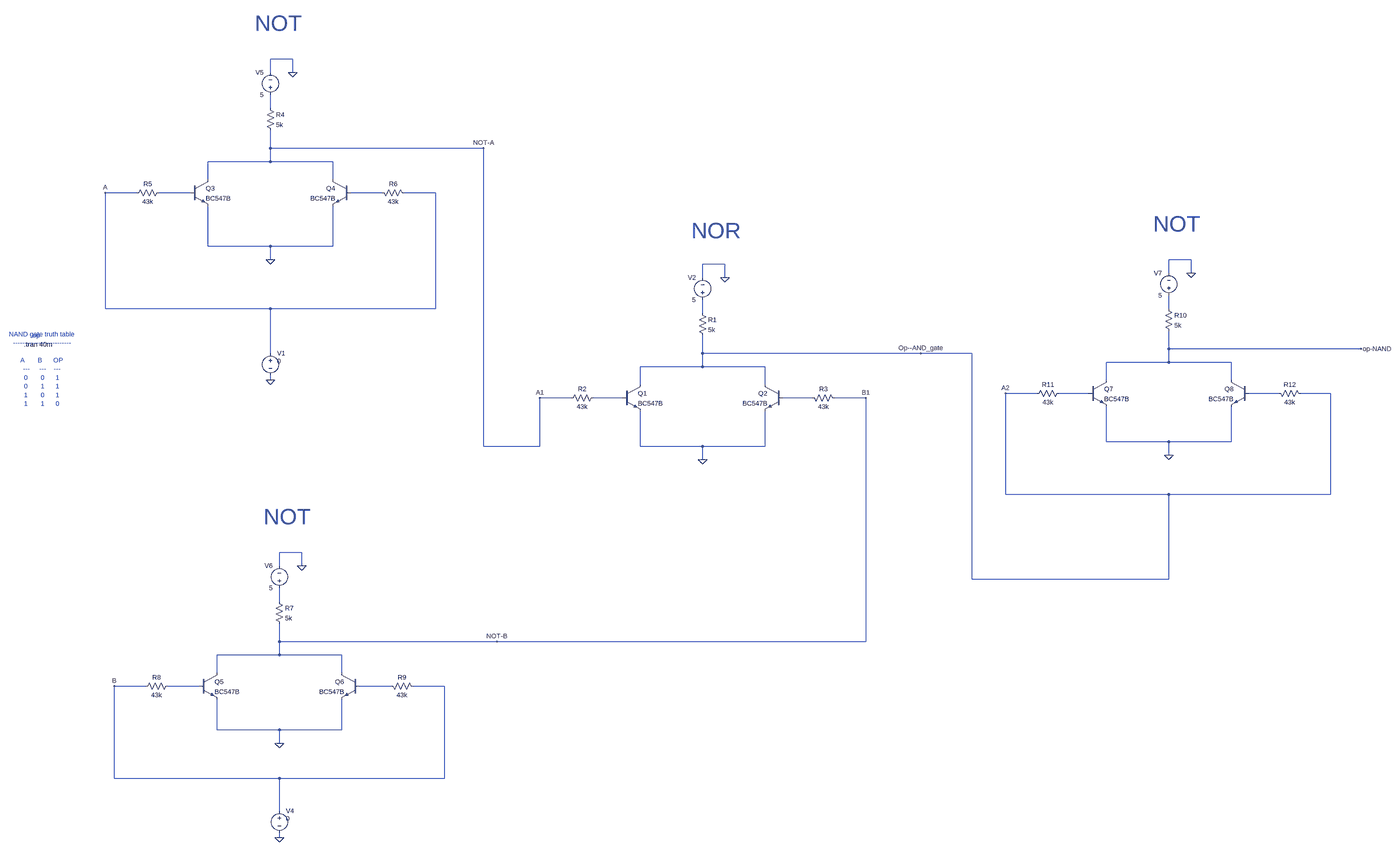
[diagram p0: schematic NAND_using_NOR_gate.asc, whole sheet]
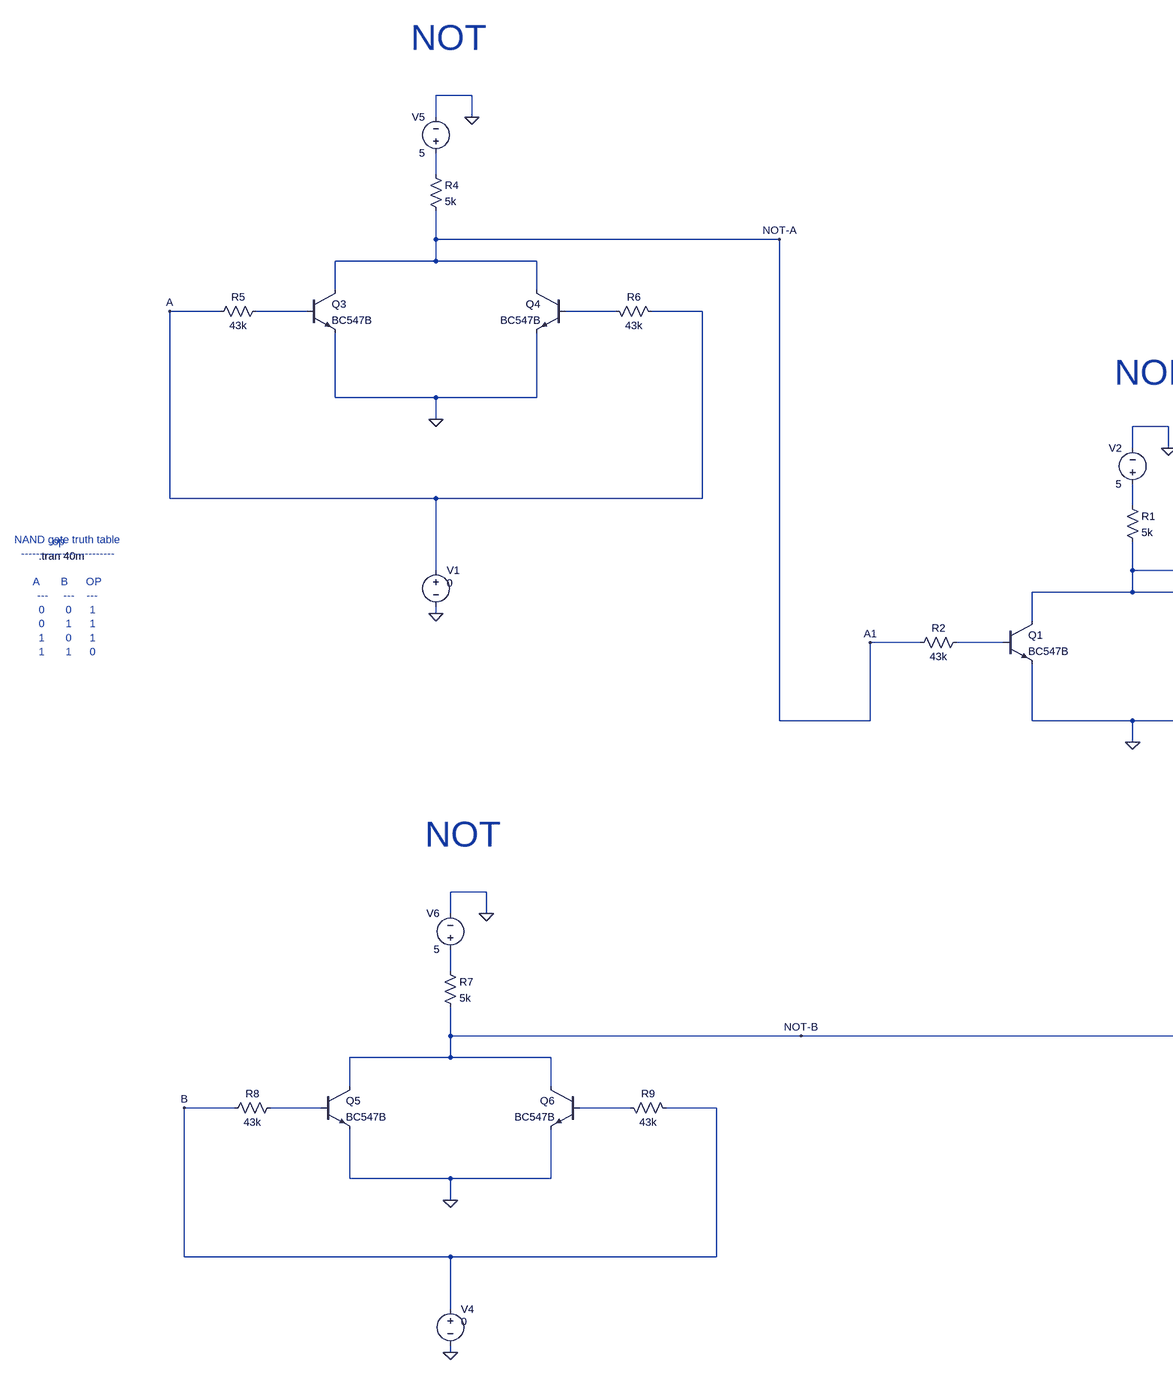
[diagram p1: schematic NAND_using_NOR_gate.asc, part, row 1 of 1, column 1 of 2]
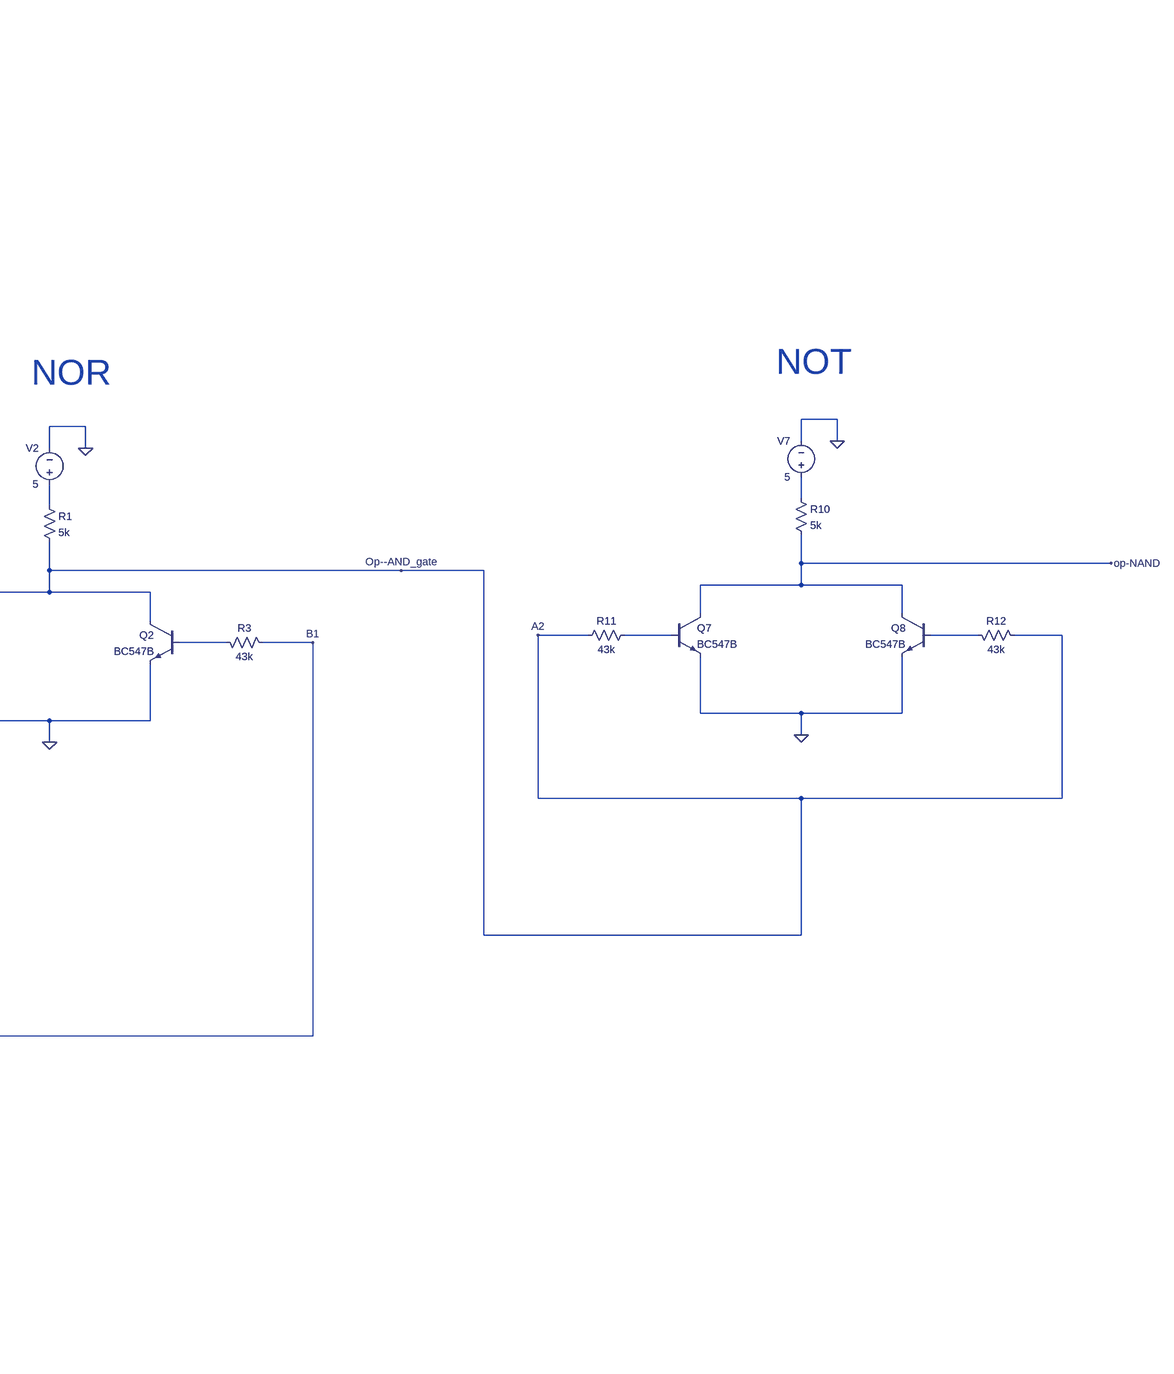
[diagram p2: schematic NAND_using_NOR_gate.asc, part, row 1 of 1, column 2 of 2]
NAND_using_NOR_gate.asc, the LTspice schematic file:
Version 4.1
SHEET 1 6012 2052
WIRE 832 -944 752 -944
WIRE 752 -896 752 -944
WIRE 832 -896 832 -944
WIRE 752 -768 752 -816
WIRE 752 -624 752 -688
WIRE 1584 -624 752 -624
WIRE 752 -576 752 -624
WIRE 752 -576 528 -576
WIRE 976 -576 752 -576
WIRE 528 -512 528 -576
WIRE 976 -512 976 -576
WIRE 272 -464 160 -464
WIRE 464 -464 352 -464
WIRE 1152 -464 1040 -464
WIRE 1344 -464 1232 -464
WIRE 528 -272 528 -416
WIRE 752 -272 528 -272
WIRE 976 -272 976 -416
WIRE 976 -272 752 -272
WIRE 752 -224 752 -272
WIRE 5136 -224 5056 -224
WIRE 2768 -208 2688 -208
WIRE 5056 -176 5056 -224
WIRE 5136 -176 5136 -224
WIRE 2688 -160 2688 -208
WIRE 2768 -160 2768 -208
WIRE 160 -48 160 -464
WIRE 752 -48 160 -48
WIRE 1344 -48 1344 -464
WIRE 1344 -48 752 -48
WIRE 5056 -48 5056 -96
WIRE 2688 -32 2688 -80
WIRE 5056 96 5056 32
WIRE 5888 96 5056 96
WIRE 752 112 752 -48
WIRE 2688 112 2688 48
WIRE 3520 112 2688 112
WIRE 4000 112 3520 112
WIRE 5056 144 5056 96
WIRE 5056 144 4832 144
WIRE 5280 144 5056 144
WIRE 2688 160 2688 112
WIRE 2688 160 2464 160
WIRE 2912 160 2688 160
WIRE 752 208 752 192
WIRE 4832 208 4832 144
WIRE 5280 208 5280 144
WIRE 2464 224 2464 160
WIRE 2912 224 2912 160
WIRE 4576 256 4464 256
WIRE 4768 256 4656 256
WIRE 5456 256 5344 256
WIRE 5648 256 5536 256
WIRE 2208 272 2096 272
WIRE 2400 272 2288 272
WIRE 3088 272 2976 272
WIRE 3280 272 3168 272
WIRE 4832 448 4832 304
WIRE 5056 448 4832 448
WIRE 5280 448 5280 304
WIRE 5280 448 5056 448
WIRE 1584 464 1584 -624
WIRE 2096 464 2096 272
WIRE 2096 464 1584 464
WIRE 2464 464 2464 320
WIRE 2688 464 2464 464
WIRE 2912 464 2912 320
WIRE 2912 464 2688 464
WIRE 5056 496 5056 448
WIRE 2688 512 2688 464
WIRE 4464 672 4464 256
WIRE 5056 672 4464 672
WIRE 5648 672 5648 256
WIRE 5648 672 5056 672
WIRE 864 880 784 880
WIRE 784 928 784 880
WIRE 864 928 864 880
WIRE 4000 976 4000 112
WIRE 5056 976 5056 672
WIRE 5056 976 4000 976
WIRE 784 1056 784 1008
WIRE 784 1200 784 1136
WIRE 1632 1200 784 1200
WIRE 3280 1200 3280 272
WIRE 3280 1200 1632 1200
WIRE 784 1248 784 1200
WIRE 784 1248 560 1248
WIRE 1008 1248 784 1248
WIRE 560 1312 560 1248
WIRE 1008 1312 1008 1248
WIRE 304 1360 192 1360
WIRE 496 1360 384 1360
WIRE 1184 1360 1072 1360
WIRE 1376 1360 1264 1360
WIRE 560 1552 560 1408
WIRE 784 1552 560 1552
WIRE 1008 1552 1008 1408
WIRE 1008 1552 784 1552
WIRE 784 1600 784 1552
WIRE 192 1776 192 1360
WIRE 784 1776 192 1776
WIRE 1376 1776 1376 1360
WIRE 1376 1776 784 1776
WIRE 784 1936 784 1776
WIRE 784 2032 784 2016
FLAG 2096 272 A1
FLAG 752 208 0
FLAG 3280 272 B1
FLAG 2688 512 0
FLAG 2768 -160 0
FLAG 3520 112 Op--AND_gate
FLAG 160 -464 A
FLAG 752 -224 0
FLAG 832 -896 0
FLAG 784 2032 0
FLAG 192 1360 B
FLAG 784 1600 0
FLAG 864 928 0
FLAG 1584 -624 NOT-A
FLAG 1632 1200 NOT-B
FLAG 4464 256 A2
FLAG 5056 496 0
FLAG 5136 -176 0
FLAG 5888 96 op-NAND
SYMBOL voltage 752 96 R0
WINDOW 3 24 44 Left 2
WINDOW 123 0 0 Left 0
WINDOW 39 0 0 Left 0
SYMATTR Value 0
SYMATTR InstName V1
SYMBOL npn 2400 224 R0
SYMATTR InstName Q1
SYMATTR Value BC547B
SYMBOL voltage 2688 -64 R180
WINDOW 0 24 96 Left 2
WINDOW 3 24 16 Left 2
WINDOW 123 0 0 Left 0
WINDOW 39 0 0 Left 0
SYMATTR InstName V2
SYMATTR Value 5
SYMBOL res 2672 -48 R0
SYMATTR InstName R1
SYMATTR Value 5k
SYMBOL res 2304 256 R90
WINDOW 0 0 56 VBottom 2
WINDOW 3 32 56 VTop 2
SYMATTR InstName R2
SYMATTR Value 43k
SYMBOL npn 2976 224 M0
SYMATTR InstName Q2
SYMATTR Value BC547B
SYMBOL res 3072 256 M90
WINDOW 0 0 56 VBottom 2
WINDOW 3 32 56 VTop 2
SYMATTR InstName R3
SYMATTR Value 43k
SYMBOL npn 464 -512 R0
SYMATTR InstName Q3
SYMATTR Value BC547B
SYMBOL voltage 752 -800 R180
WINDOW 0 24 96 Left 2
WINDOW 3 24 16 Left 2
WINDOW 123 0 0 Left 0
WINDOW 39 0 0 Left 0
SYMATTR InstName V5
SYMATTR Value 5
SYMBOL res 736 -784 R0
SYMATTR InstName R4
SYMATTR Value 5k
SYMBOL res 368 -480 R90
WINDOW 0 0 56 VBottom 2
WINDOW 3 32 56 VTop 2
SYMATTR InstName R5
SYMATTR Value 43k
SYMBOL npn 1040 -512 M0
SYMATTR InstName Q4
SYMATTR Value BC547B
SYMBOL res 1136 -480 M90
WINDOW 0 0 56 VBottom 2
WINDOW 3 32 56 VTop 2
SYMATTR InstName R6
SYMATTR Value 43k
SYMBOL voltage 784 1920 R0
WINDOW 3 24 44 Left 2
WINDOW 123 0 0 Left 0
WINDOW 39 0 0 Left 0
SYMATTR Value 0
SYMATTR InstName V4
SYMBOL npn 496 1312 R0
SYMATTR InstName Q5
SYMATTR Value BC547B
SYMBOL voltage 784 1024 R180
WINDOW 0 24 96 Left 2
WINDOW 3 24 16 Left 2
WINDOW 123 0 0 Left 0
WINDOW 39 0 0 Left 0
SYMATTR InstName V6
SYMATTR Value 5
SYMBOL res 768 1040 R0
SYMATTR InstName R7
SYMATTR Value 5k
SYMBOL res 400 1344 R90
WINDOW 0 0 56 VBottom 2
WINDOW 3 32 56 VTop 2
SYMATTR InstName R8
SYMATTR Value 43k
SYMBOL npn 1072 1312 M0
SYMATTR InstName Q6
SYMATTR Value BC547B
SYMBOL res 1168 1344 M90
WINDOW 0 0 56 VBottom 2
WINDOW 3 32 56 VTop 2
SYMATTR InstName R9
SYMATTR Value 43k
SYMBOL npn 4768 208 R0
SYMATTR InstName Q7
SYMATTR Value BC547B
SYMBOL voltage 5056 -80 R180
WINDOW 0 24 96 Left 2
WINDOW 3 24 16 Left 2
WINDOW 123 0 0 Left 0
WINDOW 39 0 0 Left 0
SYMATTR InstName V7
SYMATTR Value 5
SYMBOL res 5040 -64 R0
SYMATTR InstName R10
SYMATTR Value 5k
SYMBOL res 4672 240 R90
WINDOW 0 0 56 VBottom 2
WINDOW 3 32 56 VTop 2
SYMATTR InstName R11
SYMATTR Value 43k
SYMBOL npn 5344 208 M0
SYMATTR InstName Q8
SYMATTR Value BC547B
SYMBOL res 5440 240 M90
WINDOW 0 0 56 VBottom 2
WINDOW 3 32 56 VTop 2
SYMATTR InstName R12
SYMATTR Value 43k
TEXT -800 80 Left 2 !.tran 40m
TEXT -776 48 Left 2 ;.op
TEXT -736 168 Center 2 ;NAND gate truth table\n-------------------------\n \nA       B      OP\n---     ---    ---\n0       0      1\n0       1      1\n1       0      1\n1       1      0
TEXT 2648 -328 Left 6 ;NOR
TEXT 696 -1072 Left 6 ;NOT
TEXT 728 752 Left 6 ;NOT
TEXT 5000 -352 Left 6 ;NOT

The netlist it stands for:
* NAND_using_NOR_gate.asc
V1 A 0 0
Q1 A2 N008 0 0 BC547B
V2 N005 0 5
R1 N005 A2 5k
R2 N008 NOT-A 43k
Q2 A2 N009 0 0 BC547B
R3 N009 NOT-B 43k
Q3 NOT-A N002 0 0 BC547B
V5 N001 0 5
R4 N001 NOT-A 5k
R5 N002 A 43k
Q4 NOT-A N003 0 0 BC547B
R6 N003 A 43k
V4 B 0 0
Q5 NOT-B N011 0 0 BC547B
V6 N010 0 5
R7 N010 NOT-B 5k
R8 N011 B 43k
Q6 NOT-B N012 0 0 BC547B
R9 N012 B 43k
Q7 op-NAND N006 0 0 BC547B
V7 N004 0 5
R10 N004 op-NAND 5k
R11 N006 A2 43k
Q8 op-NAND N007 0 0 BC547B
R12 N007 A2 43k
.model NPN NPN
.model PNP PNP
.lib standard.bjt
.tran 40m
* .op
* NAND gate truth table
* -------------------------
* A       B      OP
* ---     ---    ---
* 0       0      1
* 0       1      1
* 1       0      1
* 1       1      0
* NOR
* NOT
* NOT
* NOT
.backanno
.end